# Altium schematic sheet PG_N_Indicator.SchDoc
size A
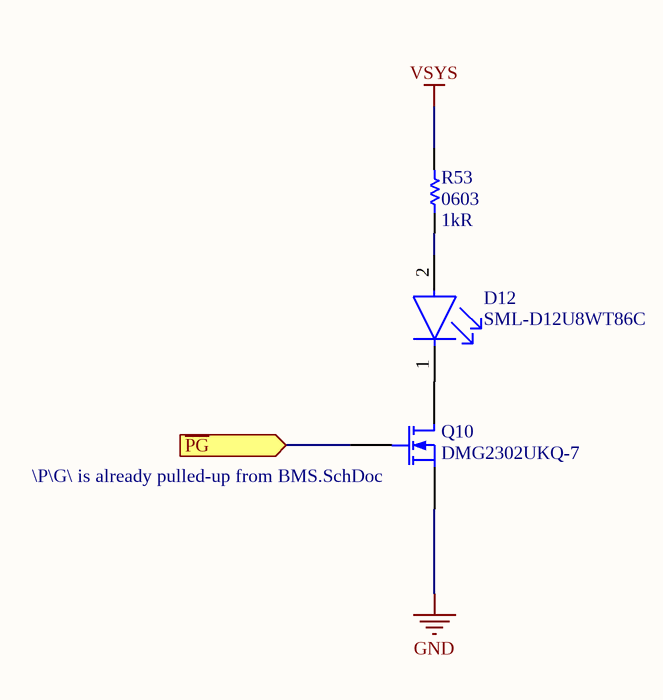
[diagram p0: PG_N_Indicator.SchDoc]

## Parts
D12  SML-D12U8WT86C  [FP-SML-D12-MFG]
Q10  Manufacturer Part Number: DMG2302UKQ-7  [*SOT23]
R53  Package / Case: 0603  Resistance: 1kR  [RES0603]  (hidden comment: Resistor 0603)

## Ports
~{PG} (in)

## Nets
GND: Q10.2(S)
VSYS: R53.2
~{PG}: Q10.1(G) ; port ~{PG}
NetD12_1: D12.1(C) Q10.3(D)
NetD12_2: D12.2(A) R53.1

## Notes on the sheet
- (near Q10) \P\G\ is already pulled-up from BMS.SchDoc

## Library data of the parts
D12 = CMP-08952-000014-1: LED RED 1608 SMD; Manufacturer: Rohm; Reverse Voltage: 5V; Wavelength: 620nm; Luminous Intensity: 63mcd; Automotive Grade: Grade 3; Forward Voltage: 2.2V; Led Orientation: Top View; Forward Current: 20mA; Power Dissipation: 54mW; Mouser Description: LED Uni-Color Red Automotive 2-Pin Chip 0603(1608Metric) T/R; Colour: Red; ComponentLink2Description: Datasheet; Category: Diode; Package: SML-D12; RoHS: TRUE; Temperature Range Low: -40°C; Lead Free: Yes; Height: 0.65mm; Manufacturer Part Number: SML-D12U8WT86C; Digikey Description: LED RED 1608 SMD; Octopart: https://octopart.com/sml-d12u8wt86c-rohm-77740214; Device Class L3: unset; Temperature Range High: +85°C; Device Class L1: Optoelectronics; ComponentLink2URL: https://fscdn.rohm.com/en/products/databook/datasheet/opto/led/chip_mono/sml-d12x8(c)-e.pdf; Device Class L2: LEDs; Temperature: -40°C to +85°C; Automotive: Yes
Q10 = DMG2302UK-7: Mosfet, N-ch, 20V, 2.8A, SOT-23 Rohs Compliant: Yes; Manufacturer: Diodes; Rds On Max: 90mR; Input Capacitance: 130pF; Max Power Dissipation: 660mW; Supplier 1: Digi-Key; Supplier Part Number 1: 31-DMG2302UKQ-7CT-ND; RoHS: Yes; Stock 1: 126285; Pricing 1: 1=0.48000, 10=0.36000, 100=0.22400, 500=0.15330, 1000=0.11792 (USD); Mount: Surface Mount; Case/Package: SOT-23; Min Operating Temperature: -55°C; Max Operating Temperature: 150°C; Packaging: Tape and Reel; Drain to Source Voltage (Vdss): 20V; Continuous Drain Current (ID): 2.8A
R53 = Resistor 0603: Res Thick Film 0603 1K Ohm 1% 0.25W(1/4W) ±100ppm/°C Epoxy Resin Pad SMD Automotive T/R; Manufacturer: Rohm; Manufacturer Part Number: ESR03EZPF1001; Power Rating: 250mW; Supplier 1: Digi-Key; Supplier Part Number 1: RHM1.00KADCT-ND; RoHS: Yes; Category: Chip SMD Resistors; Stock 1: 429236; Pricing 1: 1=0.13000, 10=0.12000, 100=0.04600, 1000=0.02024, 2500=0.01748 (USD); Case/Package: 0603; Case Code (Metric): 1608; Case Code (Imperial): 0603; Size Code: 0603; Min Operating Temperature: -55°C; Max Operating Temperature: 155°C; Package Quantity: 1; Tolerance: 1%; Packaging: Tape and Reel; Resistor Type: Thick Film; Number of Terminations: 2; Temperature Coefficient: 100ppm/°C; Max Power Dissipation: 250mW; Features: Automotive AEC-Q200; Series: ESR; Length: 0.063inch; Width: 0.031inch; Height: 0.022inch; Lead Free: Lead Free; RoHS Compliant: Yes; ComponentLink1URL: https://datasheet.ciiva.com/2469/esr-2469712.pdf?src-supplier=Digi-Key; ComponentLink1Description: https://datasheet.ciiva.com/2469/esr-2469712.pdf?src-supplier=Digi-Key; ComponentLink2URL: https://datasheet.ciiva.com/2469/esr-2469713.pdf?src-supplier=Digi-Key; ComponentLink2Description: https://datasheet.ciiva.com/2469/esr-2469713.pdf?src-supplier=Digi-Key; ComponentLink3URL: https://datasheet.ciiva.com/2469/esr-2469714.pdf?src-supplier=Digi-Key; ComponentLink3Description: https://datasheet.ciiva.com/2469/esr-2469714.pdf?src-supplier=Digi-Key